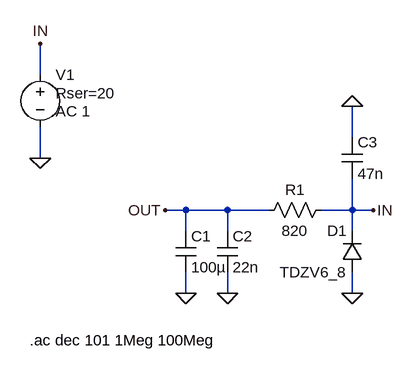
[diagram p0: schematic Draft2.asc]
Draft2.asc, the LTspice schematic file:
Version 4.1
SHEET 1 880 680
WIRE -208 -112 -208 -160
WIRE 272 -16 272 -64
WIRE -208 16 -208 -32
WIRE 16 96 -16 96
WIRE 80 96 16 96
WIRE 144 96 80 96
WIRE 272 96 272 48
WIRE 272 96 224 96
WIRE 304 96 272 96
WIRE 16 128 16 96
WIRE 80 128 80 96
WIRE 272 128 272 96
WIRE 16 224 16 192
WIRE 80 224 80 192
WIRE 272 224 272 192
FLAG 272 224 0
FLAG 16 224 0
FLAG 80 224 0
FLAG 304 96 IN
FLAG -16 96 OUT
FLAG -208 16 0
FLAG -208 -160 IN
FLAG 272 -64 0
SYMBOL diode 288 192 R180
WINDOW 0 24 64 Left 2
WINDOW 3 24 0 Left 2
SYMATTR InstName D1
SYMATTR Value TDZV6_8
SYMBOL res 240 80 R90
WINDOW 0 0 56 VBottom 2
WINDOW 3 32 56 VTop 2
SYMATTR InstName R1
SYMATTR Value 820
SYMBOL voltage -208 -128 R0
WINDOW 3 24 44 Left 2
WINDOW 123 24 72 Left 2
WINDOW 39 24 44 Left 2
SYMATTR InstName V1
SYMATTR Value ""
SYMATTR Value2 AC 1
SYMATTR SpiceLine Rser=20
SYMBOL cap 256 -16 R0
SYMATTR InstName C3
SYMATTR Value 47n
SYMATTR SpiceLine Rser=10m Lser=1n
SYMBOL cap 0 128 R0
SYMATTR InstName C1
SYMATTR Value 100µ
SYMATTR SpiceLine Rser=0.4 Lser=8n
SYMBOL cap 64 128 R0
SYMATTR InstName C2
SYMATTR Value 22n
SYMATTR SpiceLine Rser=10m Lser=10p
TEXT -224 296 Left 2 !.ac dec 101 1Meg 100Meg

The netlist it stands for:
* Draft2.asc
D1 0 IN TDZV6_8
R1 IN OUT 820
V1 IN 0 AC 1 Rser=20
C3 0 IN 47n Rser=10m Lser=1n
C1 OUT 0 100µ Rser=0.4 Lser=8n
C2 OUT 0 22n Rser=10m Lser=10p
.model D D
.lib standard.dio
.ac dec 101 1Meg 100Meg
.backanno
.end